# Altium schematic sheet STM32.SchDoc
size A3
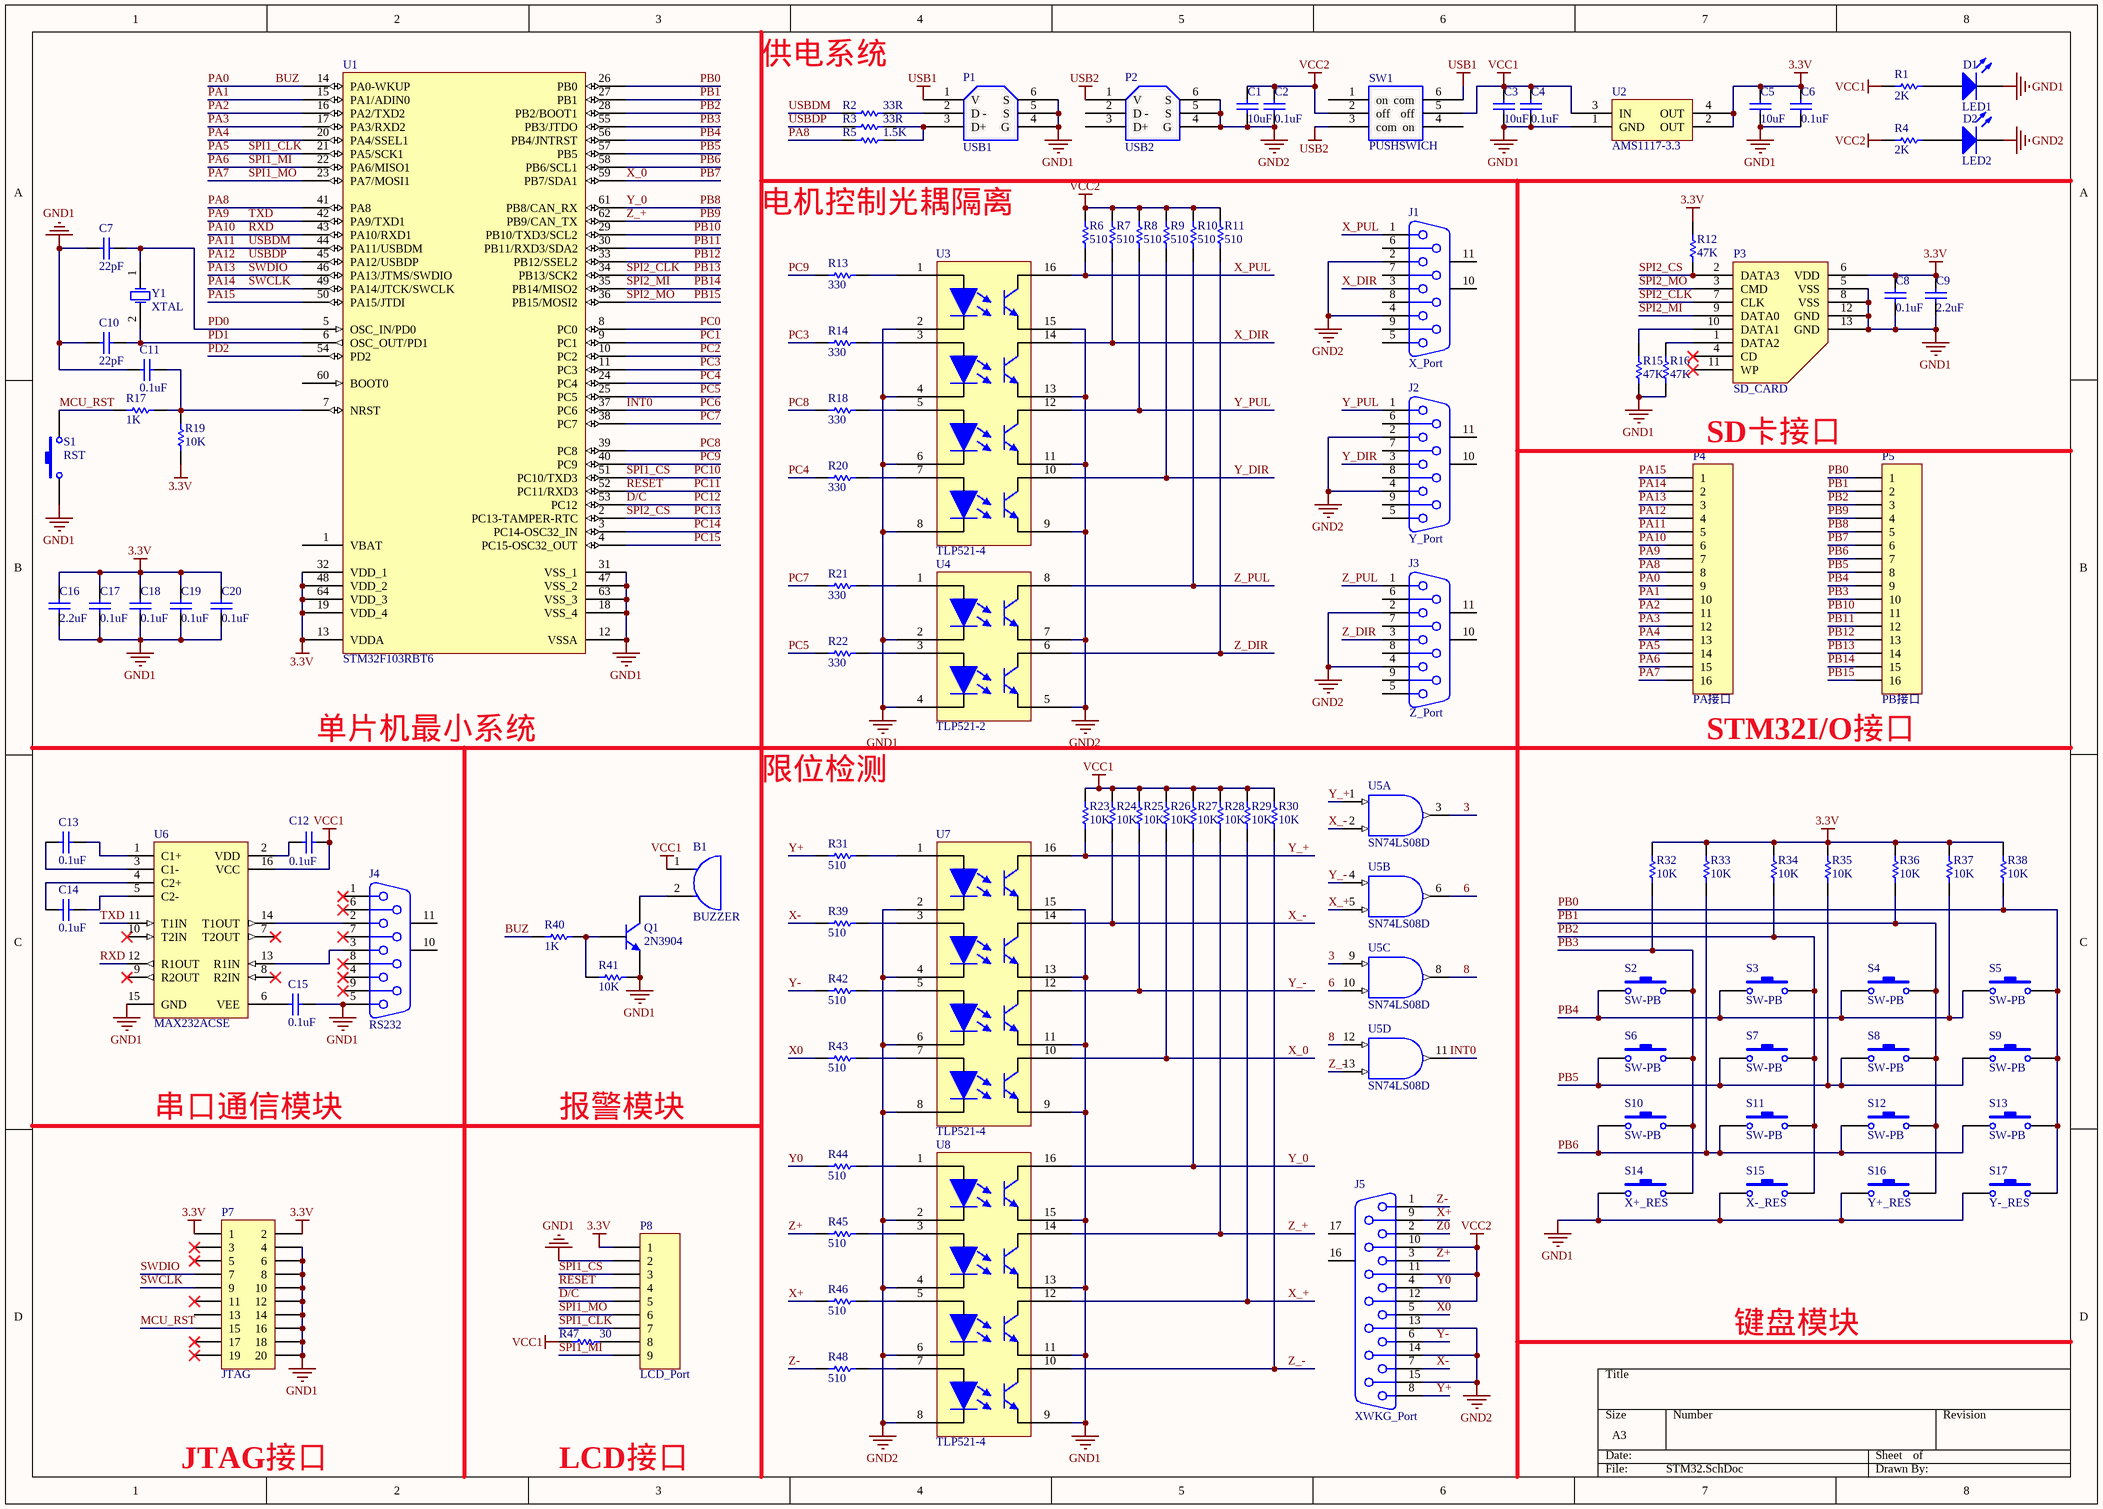
[diagram p0: STM32.SchDoc]

## Parts
B1  BUZZER  [BUZZER]
C1  value 10uF  [0805]  (hidden comment: Cap)
C2  value 0.1uF  [0805]  (hidden comment: Cap)
C3  value 10uF  [0805]  (hidden comment: Cap)
C4  value 0.1uF  [0805]  (hidden comment: Cap)
C5  value 10uF  [0805]  (hidden comment: Cap)
C6  value 0.1uF  [0805]  (hidden comment: Cap)
C7  value 22pF  [0805]  (hidden comment: Cap)
C8  value 0.1uF  [0805]  (hidden comment: Cap)
C9  value 2.2uF  [0805]  (hidden comment: Cap)
C10  value 22pF  [0805]  (hidden comment: Cap)
C11  value 0.1uF  [0805]  (hidden comment: Cap)
C12  value 0.1uF  [0805]  (hidden comment: Cap)
C13  value 0.1uF  [0805]  (hidden comment: Cap)
C14  value 0.1uF  [0805]  (hidden comment: Cap)
C15  value 0.1uF  [0805]  (hidden comment: Cap)
C16  value 2.2uF  [0805]  (hidden comment: Cap)
C17  value 0.1uF  [0805]  (hidden comment: Cap)
C18  value 0.1uF  [0805]  (hidden comment: Cap)
C19  value 0.1uF  [0805]  (hidden comment: Cap)
C20  value 0.1uF  [0805]  (hidden comment: Cap)
D1  LED1  [0805]
D2  LED2  [0805]
J1  X_Port  [DSUB1.385-2H9]
J2  Y_Port  [DSUB1.385-2H9]
J3  Z_Port  [DSUB1.385-2H9]
J4  RS232  [DSUB1.385-2H9]
J5  XWKG_Port  [DSUB1.385-2H15]
P1  USB1  [USB]
P2  USB2  [USB]
P3  SD_CARD  [SD_CARD]
P4  PA接口  [HDR1X16]
P5  PB接口  [HDR1X16]
P7  JTAG  [JTAG]
P8  LCD_Port  [HDR1X9]
Q1  2N3904  [TO-92A]
R1  value 2K  [0805]
R2  value 33R  [0805]
R3  value 33R  [0805]
R4  value 2K  [0805]
R5  value 1.5K  [0805]
R6  value 510  [0805]
R7  value 510  [0805]
R8  value 510  [0805]
R9  value 510  [0805]
R10  value 510  [0805]
R11  value 510  [0805]
R12  value 47K  [0805]
R13  value 330  [0805]
R14  value 330  [0805]
R15  value 47K  [0805]
R16  value 47K  [0805]
R17  value 1K  [0805]
R18  value 330  [0805]
R19  value 10K  [0805]
R20  value 330  [0805]
R21  value 330  [0805]
R22  value 330  [0805]
R23  value 10K  [0805]
R24  value 10K  [0805]
R25  value 10K  [0805]
R26  value 10K  [0805]
R27  value 10K  [0805]
R28  value 10K  [0805]
R29  value 10K  [0805]
R30  value 10K  [0805]
R31  value 510  [0805]
R32  value 10K  [0805]
R33  value 10K  [0805]
R34  value 10K  [0805]
R35  value 10K  [0805]
R36  value 10K  [0805]
R37  value 10K  [0805]
R38  value 10K  [0805]
R39  value 510  [0805]
R40  value 1K  [0805]
R41  value 10K  [0805]
R42  value 510  [0805]
R43  value 510  [0805]
R44  value 510  [0805]
R45  value 510  [0805]
R46  value 510  [0805]
R47  value 30  [0805]
R48  value 510  [0805]
S1  RST  [SW-PB]
S2  SW-PB  [SW-PB]
S3  SW-PB  [SW-PB]
S4  SW-PB  [SW-PB]
S5  SW-PB  [SW-PB]
S6  SW-PB  [SW-PB]
S7  SW-PB  [SW-PB]
S8  SW-PB  [SW-PB]
S9  SW-PB  [SW-PB]
S10  SW-PB  [SW-PB]
S11  SW-PB  [SW-PB]
S12  SW-PB  [SW-PB]
S13  SW-PB  [SW-PB]
S14  X+_RES  [SW-PB]
S15  X-_RES  [SW-PB]
S16  Y+_RES  [SW-PB]
S17  Y-_RES  [SW-PB]
SW1  PUSHSWICH  [DPDT-6]
U1  STM32F103RBT6  [LQFP64_L]
U2  AMS1117-3.3  [SOT223]
U3  TLP521-4  [DIP-16]
U4  TLP521-2  [DIP-8]
U5  SN74LS08D  [D014_N]  (parts A,B,C,D of 4)
U6  MAX232ACSE  [NSO16_N]
U7  TLP521-4  [DIP-16]
U8  TLP521-4  [DIP-16]
Y1  XTAL  [JZ]

## Nets
3.3V: C5.2 C6.2 C8.2 C9.2 C16.2 C17.2 C18.2 C19.2 C20.2 P3.6(VDD) P7.1 P7.2 P8.1 R12.2 R19.1 R32.1 R33.1 R34.1 R35.1 R36.1 R37.1 R38.1 U1.13(VDDA) U1.19(VDD_4) U1.32(VDD_1) U1.48(VDD_2) U1.64(VDD_3) U2.2(OUT) U2.4(OUT)
GND: U5.7(GND)
GND1: C3.1 C4.1 C5.1 C6.1 C7.1 C8.1 C9.1 C10.1 C11.1 C15.2 C16.1 C17.1 C18.1 C19.1 C20.1 D1.2(K) J4.5 P1.4(G) P1.5(S) P1.6(S) P3.5(VSS) P3.8(VSS) P3.12(GND) P3.13(GND) P7.4 P7.6 P7.8 P7.10 P7.12 P7.14 P7.16 P7.18 P7.20 P8.2 Q1.1(E) R15.1 R16.1 R41.1 S1.1 S14.1 S15.1 S16.1 S17.1 U1.12(VSSA) U1.18(VSS_4) U1.31(VSS_1) U1.47(VSS_2) U1.63(VSS_3) U2.1(GND) U3.2 U3.4 U3.6 U3.8 U4.2 U4.4 U6.15(GND) U7.9 U7.11 U7.13 U7.15 U8.9 U8.11 U8.13 U8.15
GND2: C1.1 C2.1 D2.2(K) J1.2 J1.4 J2.2 J2.4 J3.2 J3.4 J5.13 J5.14 J5.15 P2.4(G) P2.5(S) P2.6(S) U3.9 U3.11 U3.13 U3.15 U4.5 U4.7 U7.2 U7.4 U7.6 U7.8 U8.2 U8.4 U8.6 U8.8
USB1: P1.1(V) SW1.6(com)
USB2: P2.1(V) SW1.3(com)
VCC: U5.14(VCC)
VCC1: B1.1(A) C3.2 C4.2 C12.2 R1.1 R23.1 R24.1 R25.1 R26.1 R27.1 R28.1 R29.1 R30.1 R47.1 SW1.5(off) U2.3(IN) U6.16(VCC)
VCC2: C1.2 C2.2 J5.10 J5.11 J5.12 R4.1 R6.1 R7.1 R8.1 R9.1 R10.1 R11.1 SW1.2(off)
3: U5.3(Y) U5.9(A)
6: U5.6(Y) U5.10(B)
8: U5.8(Y) U5.12(A)
BUZ: P4.9 R40.1 U1.14(PA0-WKUP)  [also labelled PA0]
D/C: P8.5 U1.53(PC12)  [also labelled PC12]
INT0: U1.37(PC6) U5.11(Y)  [also labelled PC6]
MCU_RST: P7.15 R17.2 S1.2
PA1: P4.10 U1.15(PA1/ADIN0)
PA2: P4.11 U1.16(PA2/TXD2)
PA3: P4.12 U1.17(PA3/RXD2)
PA4: P4.13 U1.20(PA4/SSEL1)
PA5: P4.14 P8.7 U1.21(PA5/SCK1)  [also labelled SPI1_CLK]
PA6: P4.15 P8.9 U1.22(PA6/MISO1)  [also labelled SPI1_MI]
PA7: P4.16 P8.6 U1.23(PA7/MOSI1)  [also labelled SPI1_MO]
PA8: P4.8 R5.1 U1.41(PA8)
PA9: P4.7 U1.42(PA9/TXD1) U6.11(T1IN)  [also labelled TXD]
PA10: P4.6 U1.43(PA10/RXD1) U6.12(R1OUT)  [also labelled RXD]
PA11: P4.5 R2.1 U1.44(PA11/USBDM)  [also labelled USBDM]
PA12: P4.4 R3.1 U1.45(PA12/USBDP)  [also labelled USBDP]
PA13: P4.3 P7.7 U1.46(PA13/JTMS/SWDIO)  [also labelled SWDIO]
PA14: P4.2 P7.9 U1.49(PA14/JTCK/SWCLK)  [also labelled SWCLK]
PA15: P4.1 U1.50(PA15/JTDI)
PB0: P5.1 R38.2 S5.2 S9.2 S13.2 S17.2 U1.26(PB0)
PB1: P5.2 R36.2 S4.2 S8.2 S12.2 S16.2 U1.27(PB1)
PB2: P5.3 R34.2 S3.2 S7.2 S11.2 S15.2 U1.28(PB2/BOOT1)
PB3: P5.10 R32.2 S2.2 S6.2 S10.2 S14.2 U1.55(PB3/JTDO)
PB4: P5.9 R37.2 S2.1 S3.1 S4.1 S5.1 U1.56(PB4/JNTRST)
PB5: P5.8 R35.2 S6.1 S7.1 S8.1 S9.1 U1.57(PB5)
PB6: P5.7 R33.2 S10.1 S11.1 S12.1 S13.1 U1.58(PB6/SCL1)
PB7: P5.6 R26.2 U1.59(PB7/SDA1) U7.10  [also labelled X_0]
PB8: P5.5 R27.2 U1.61(PB8/CAN_RX) U8.16  [also labelled Y_0]
PB9: P5.4 R28.2 U1.62(PB9/CAN_TX) U8.14  [also labelled Z_+]
PB10: P5.11 U1.29(PB10/TXD3/SCL2)
PB11: P5.12 U1.30(PB11/RXD3/SDA2)
PB12: P5.13 U1.33(PB12/SSEL2)
PB13: P3.7(CLK) P5.14 U1.34(PB13/SCK2)  [also labelled SPI2_CLK]
PB14: P3.9(DATA0) P5.15 U1.35(PB14/MISO2)  [also labelled SPI2_MI]
PB15: P3.3(CMD) P5.16 U1.36(PB15/MOSI2)  [also labelled SPI2_MO]
PC0: U1.8(PC0)
PC1: U1.9(PC1)
PC2: U1.10(PC2)
PC3: R14.2 U1.11(PC3)
PC4: R20.2 U1.24(PC4)
PC5: R22.2 U1.25(PC5)
PC7: R21.2 U1.38(PC7)
PC8: R18.2 U1.39(PC8)
PC9: R13.2 U1.40(PC9)
PC10: P8.3 U1.51(PC10/TXD3)  [also labelled SPI1_CS]
PC11: P8.4 U1.52(PC11/RXD3)  [also labelled RESET]
PC13: P3.2(DATA3) R12.1 U1.2(PC13-TAMPER-RTC)  [also labelled SPI2_CS]
PC14: U1.3(PC14-OSC32_IN)
PC15: U1.4(PC15-OSC32_OUT)
PD0: C7.2 U1.5(OSC_IN/PD0) Y1.1(OSC1)
PD1: C10.2 U1.6(OSC_OUT/PD1) Y1.2(OSC2)
PD2: U1.54(PD2)
X0: J5.5 R43.2
X+: J5.9 R46.2
X-: J5.7 R39.2
X_+: R29.2 U5.5(B) U8.12
X_-: R24.2 U5.2(B) U7.14
X_DIR: J1.3 R7.2 U3.14
X_PUL: J1.1 R6.2 U3.16
Y0: J5.4 R44.2
Y+: J5.8 R31.2
Y-: J5.6 R42.2
Y_+: R23.2 U5.1(A) U7.16
Y_-: R25.2 U5.4(A) U7.12
Y_DIR: J2.3 R9.2 U3.10
Y_PUL: J2.1 R8.2 U3.12
Z0: J5.2
Z+: J5.3 R45.2
Z-: J5.1 R48.2
Z_-: R30.2 U5.13(B) U8.10
Z_DIR: J3.3 R11.2 U4.6
Z_PUL: J3.1 R10.2 U4.8
NetB1_2: B1.2(B) Q1.3(C)
NetC11_2: C11.2 R17.1 R19.2 U1.7(NRST)
NetC12_1: C12.1 U6.2(VDD)
NetC13_1: C13.1 U6.3(C1-)
NetC13_2: C13.2 U6.1(C1+)
NetC14_1: C14.1 U6.4(C2+)
NetC14_2: C14.2 U6.5(C2-)
NetC15_1: C15.1 U6.6(VEE)
NetD1_1: D1.1(A) R1.2
NetD2_1: D2.1(A) R4.2
NetJ4_2: J4.2 U6.14(T1OUT)
NetJ4_3: J4.3 U6.13(R1IN)
NetP1_2: P1.2(D_-) R2.2
NetP1_3: P1.3(D+) R3.2 R5.2
NetP3_1: P3.1(DATA2) R16.2
NetP3_10: P3.10(DATA1) R15.2
NetP8_8: P8.8 R47.2
NetQ1_2: Q1.2(B) R40.2 R41.2
NetR13_1: R13.1 U3.1
NetR14_1: R14.1 U3.3
NetR18_1: R18.1 U3.5
NetR20_1: R20.1 U3.7
NetR21_1: R21.1 U4.1
NetR22_1: R22.1 U4.3
NetR31_1: R31.1 U7.1
NetR39_1: R39.1 U7.3
NetR42_1: R42.1 U7.5
NetR43_1: R43.1 U7.7
NetR44_1: R44.1 U8.1
NetR45_1: R45.1 U8.3
NetR46_1: R46.1 U8.5
NetR48_1: R48.1 U8.7

Not connected (* = marked no-connect by the designer): J1 5 6 7 8 9 10(MH1) 11(MH2); J2 5 6 7 8 9 10(MH1) 11(MH2); J3 5 6 7 8 9 10(MH1) 11(MH2); J4 1* 4* 6* 7* 8* 9* 10(MH1) 11(MH2); J5 16(MH1) 17(MH2); P2 2(D_-) 3(D+); P3 4(CD)* 11(WP)*; P7 3* 5* 11* 13 17* 19*; SW1 1(on) 4(on); U1 1(VBAT) 60(BOOT0); U6 7(T2OUT)* 8(R2IN)* 9(R2OUT)* 10(T2IN)*

## Notes on the sheet
- 供电系统
- 电机控制光耦隔离
- SD卡接口
- 单片机最小系统
- 限位检测
- STM32I/O接口
- 串口通信模块
- 报警模块
- 键盘模块
- JTAG接口
- LCD接口

## Library data of the parts
C1-C20 = Cap: Capacitor; Published: 8-Jun-2000; LatestRevisionDate: 17-Jul-2002; LatestRevisionNote: Re-released for DXP Platform.; PackageReference: RAD-0.3; Publisher: Altium Limited
D1 D2 = LED0: Typical INFRARED GaAs LED; Published: 8-Jun-2000; LatestRevisionDate: 08-Jul-2005; LatestRevisionNote: Mech Layer 1 removed.; PackageReference: LED-0; Publisher: Altium Limited
J1-J4 = D Connector 9: Receptacle Assembly, 9 Position, Right Angle; PackageDocument: O; Positions: 9; Published: 15-Jun-2001; LatestRevisionDate: 17-Jul-2002; LatestRevisionNote: Re-released for DXP Platform.; DatasheetDocument: 1-Sep-1999; PackageReference: 788750; Publisher: Altium Limited; Orientation: Right Angle; Gender: Receptacle
J5 = D Connector 15: Receptacle Assembly, 15 Position, Right Angle; PackageDocument: O; Positions: 15; Published: 15-Jun-2001; LatestRevisionDate: 17-Jul-2002; LatestRevisionNote: Re-released for DXP Platform.; DatasheetDocument: 1-Sep-99; PackageReference: 788757; Publisher: Altium Limited; Orientation: Right Angle; Gender: Receptacle
P1 P2 = USB
P4 P5 = Header 16: Header, 16-Pin; LatestRevisionDate: 17-Jul-2002; LatestRevisionNote: Re-released for DXP Platform.; Publisher: Altium Limited
P7 = Header 10X2: Header, 10-Pin, Dual row; LatestRevisionDate: 17-Jul-2002; LatestRevisionNote: Re-released for DXP Platform.; Publisher: Altium Limited
P8 = Header 9: Header, 9-Pin; LatestRevisionDate: 17-Jul-2002; LatestRevisionNote: Re-released for DXP Platform.; Publisher: Altium Limited
Q1 = 2N3904: NPN General Purpose Amplifier; Published: 8-Jun-2000; LatestRevisionDate: 15-Jan-2003; LatestRevisionNote: PCB Footprint 'BCY-W3/D4.7' replaced; DatasheetDocument: 1997; PackageDocument: Sep-1998; PackageReference: TO-92A; Publisher: Altium Limited; Code_JEDEC: TO-92A; ComponentLink1Description: Manufacturer Link; ComponentLink1URL: http://www.fairchildsemi.com/; ComponentLink2Description: Datasheet; ComponentLink2URL: http://www.fairchildsemi.com/ds/2N%2F2N3904.pdf
R1-R48 = Res Semi: Semiconductor Resistor; Published: 8-Jun-2000; LatestRevisionDate: 17-Jul-2002; LatestRevisionNote: Re-released for DXP Platform.; PackageReference: AXIAL-0.5; Publisher: Altium Limited
S1-S17 = SW-PB: Switch; Published: 24-Mar-1999; LatestRevisionDate: 17-Jul-2002; LatestRevisionNote: Re-released for DXP Platform.; PackageReference: SPST-2; Publisher: Altium Limited
U5 = SN74LS08D: Quadruple 2-Input Positive-AND Gate; Published: 8-Jun-2000; LatestRevisionDate: 13-Apr-2006; LatestRevisionNote: IPC-7351 Footprint Added.; DatasheetVersion: Mar-1988; PackageVersion: Jan-1998; PackageReference: D014; Publisher: Altium Limited; PackageDescription: 14-Pin Small Outline Integrated Circuit 1.27 mm Pitch; Code_IPC: SOIC127P600-14; ComponentLink1Description: Manufacturer Link; ComponentLink1URL: http://www.ti.com/; ComponentLink2Description: Datasheet; ComponentLink2URL: http://www-s.ti.com/sc/ds/SN74LS08.pdf
U6 = MAX232ACSE: +5V Powered, Multi-Channel RS-232 Driver/Receiver; Published: 16-Jan-2001; LatestRevisionDate: 13-Apr-2006; LatestRevisionNote: IPC-7351 Footprint Added.; PackageReference: NSO16; Publisher: Altium Limited; PackageDescription: 16-Pin Small Outline Integrated Circuit 1.27 mm Pitch; Code_JEDEC: MS-012-AC; Code_IPC: SOIC127P600-16; ComponentLink1Description: Manufacturer Link; ComponentLink1URL: http://www.maxim-ic.com/; ComponentLink2Description: Datasheet; ComponentLink2URL: http://pdfserv.maxim-ic.com/en/ds/MAX220-MAX249.pdf
Y1 = XTAL: Crystal Oscillator; Published: 8-Jun-2000; LatestRevisionDate: 17-Jul-2002; LatestRevisionNote: Re-released for DXP Platform.; PackageReference: R38; Publisher: Altium Limited